# Altium project dubberli_PCB.PrjPcb
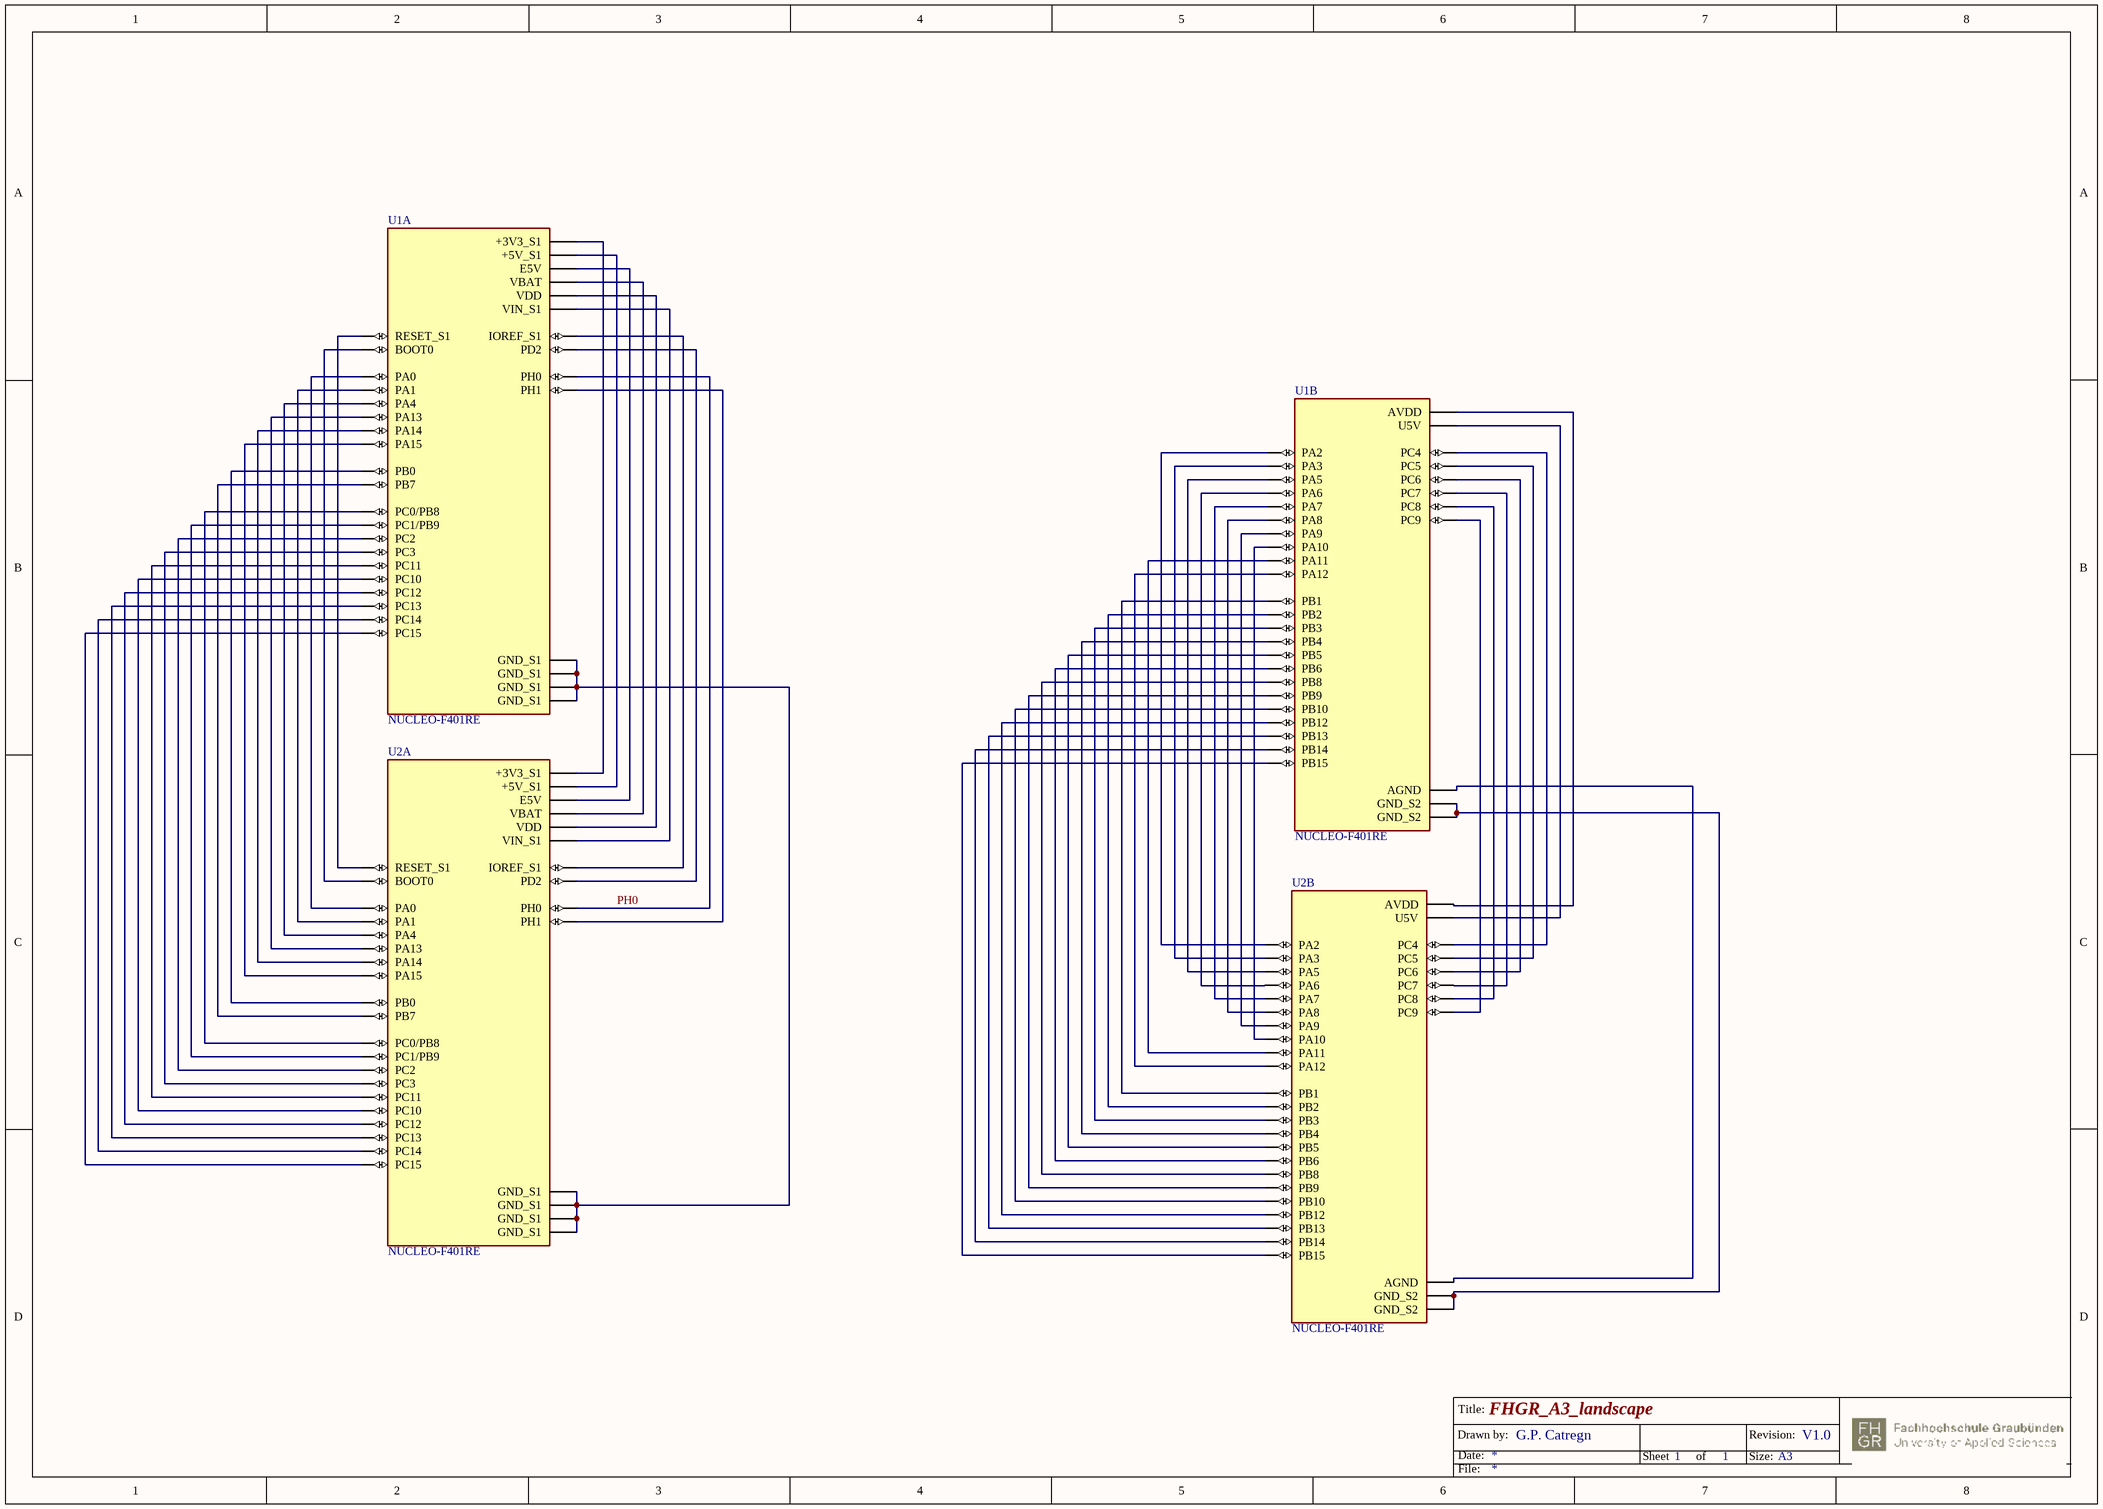
[diagram p0: Sheet1.SchDoc]
1 sheet, 2 parts. Net scope: global (net labels, ports and power ports of the same name join across sheets).
Board file: PCB1.PcbDoc

## Sheet Sheet1.SchDoc: FHGR_A3_landscape
size A3; Date: 18.07.2017; DrawnBy: G.P. Catregn; Organization: HTW Chur; Address1: Pulvermühlestrasse 57; Address2: 7004 Chur; Address3: Switzerland; DocumentNumber: 1; Revision: V1.0; SheetNumber: 1; SheetTotal: 1; DocumentName: HTW Template

### Parts
U1  NUCLEO-F401RE  [ST_NUCLEO-F401RE]  (parts A,B of 6)
U2  NUCLEO-F401RE  [ST_NUCLEO-F401RE]  (parts A,B of 6)

### Nets
PH0: U1.CN7_29(PH0) U2.CN7_29(PH0)
NetU1_CN7_1: U1.CN7_1(PC10) U2.CN7_1(PC10)
NetU1_CN7_2: U1.CN7_2(PC11) U2.CN7_2(PC11)
NetU1_CN7_3: U1.CN7_3(PC12) U2.CN7_3(PC12)
NetU1_CN7_4: U1.CN7_4(PD2) U2.CN7_4(PD2)
NetU1_CN7_5: U1.CN7_5(VDD) U2.CN7_5(VDD)
NetU1_CN7_6: U1.CN7_6(E5V) U2.CN7_6(E5V)
NetU1_CN7_7: U1.CN7_7(BOOT0) U2.CN7_7(BOOT0)
NetU1_CN7_8: U1.CN7_8(GND_S1) U1.CN7_19(GND_S1) U1.CN7_20(GND_S1) U1.CN7_22(GND_S1) U2.CN7_8(GND_S1) U2.CN7_19(GND_S1) U2.CN7_20(GND_S1) U2.CN7_22(GND_S1)
NetU1_CN7_12: U1.CN7_12(IOREF_S1) U2.CN7_12(IOREF_S1)
NetU1_CN7_13: U1.CN7_13(PA13) U2.CN7_13(PA13)
NetU1_CN7_14: U1.CN7_14(RESET_S1) U2.CN7_14(RESET_S1)
NetU1_CN7_15: U1.CN7_15(PA14) U2.CN7_15(PA14)
NetU1_CN7_16: U1.CN7_16(+3V3_S1) U2.CN7_16(+3V3_S1)
NetU1_CN7_17: U1.CN7_17(PA15) U2.CN7_17(PA15)
NetU1_CN7_18: U1.CN7_18(+5V_S1) U2.CN7_18(+5V_S1)
NetU1_CN7_21: U1.CN7_21(PB7) U2.CN7_21(PB7)
NetU1_CN7_23: U1.CN7_23(PC13) U2.CN7_23(PC13)
NetU1_CN7_24: U1.CN7_24(VIN_S1) U2.CN7_24(VIN_S1)
NetU1_CN7_25: U1.CN7_25(PC14) U2.CN7_25(PC14)
NetU1_CN7_27: U1.CN7_27(PC15) U2.CN7_27(PC15)
NetU1_CN7_28: U1.CN7_28(PA0) U2.CN7_28(PA0)
NetU1_CN7_30: U1.CN7_30(PA1) U2.CN7_30(PA1)
NetU1_CN7_31: U1.CN7_31(PH1) U2.CN7_31(PH1)
NetU1_CN7_32: U1.CN7_32(PA4) U2.CN7_32(PA4)
NetU1_CN7_33: U1.CN7_33(VBAT) U2.CN7_33(VBAT)
NetU1_CN7_34: U1.CN7_34(PB0) U2.CN7_34(PB0)
NetU1_CN7_35: U1.CN7_35(PC2) U2.CN7_35(PC2)
NetU1_CN7_36: U1.CN7_36(PC1/PB9) U2.CN7_36(PC1/PB9)
NetU1_CN7_37: U1.CN7_37(PC3) U2.CN7_37(PC3)
NetU1_CN7_38: U1.CN7_38(PC0/PB8) U2.CN7_38(PC0/PB8)
NetU1_CN10_1: U1.CN10_1(PC9) U2.CN10_1(PC9)
NetU1_CN10_2: U1.CN10_2(PC8) U2.CN10_2(PC8)
NetU1_CN10_3: U1.CN10_3(PB8) U2.CN10_3(PB8)
NetU1_CN10_4: U1.CN10_4(PC6) U2.CN10_4(PC6)
NetU1_CN10_5: U1.CN10_5(PB9) U2.CN10_5(PB9)
NetU1_CN10_6: U1.CN10_6(PC5) U2.CN10_6(PC5)
NetU1_CN10_7: U1.CN10_7(AVDD) U2.CN10_7(AVDD)
NetU1_CN10_8: U1.CN10_8(U5V) U2.CN10_8(U5V)
NetU1_CN10_9: U1.CN10_9(GND_S2) U1.CN10_20(GND_S2) U2.CN10_9(GND_S2) U2.CN10_20(GND_S2)
NetU1_CN10_11: U1.CN10_11(PA5) U2.CN10_11(PA5)
NetU1_CN10_12: U1.CN10_12(PA12) U2.CN10_12(PA12)
NetU1_CN10_13: U1.CN10_13(PA6) U2.CN10_13(PA6)
NetU1_CN10_14: U1.CN10_14(PA11) U2.CN10_14(PA11)
NetU1_CN10_15: U1.CN10_15(PA7) U2.CN10_15(PA7)
NetU1_CN10_16: U1.CN10_16(PB12) U2.CN10_16(PB12)
NetU1_CN10_17: U1.CN10_17(PB6) U2.CN10_17(PB6)
NetU1_CN10_19: U1.CN10_19(PC7) U2.CN10_19(PC7)
NetU1_CN10_21: U1.CN10_21(PA9) U2.CN10_21(PA9)
NetU1_CN10_22: U1.CN10_22(PB2) U2.CN10_22(PB2)
NetU1_CN10_23: U1.CN10_23(PA8) U2.CN10_23(PA8)
NetU1_CN10_24: U1.CN10_24(PB1) U2.CN10_24(PB1)
NetU1_CN10_25: U1.CN10_25(PB10) U2.CN10_25(PB10)
NetU1_CN10_26: U1.CN10_26(PB15) U2.CN10_26(PB15)
NetU1_CN10_27: U1.CN10_27(PB4) U2.CN10_27(PB4)
NetU1_CN10_28: U1.CN10_28(PB14) U2.CN10_28(PB14)
NetU1_CN10_29: U1.CN10_29(PB5) U2.CN10_29(PB5)
NetU1_CN10_30: U1.CN10_30(PB13) U2.CN10_30(PB13)
NetU1_CN10_31: U1.CN10_31(PB3) U2.CN10_31(PB3)
NetU1_CN10_32: U1.CN10_32(AGND) U2.CN10_32(AGND)
NetU1_CN10_33: U1.CN10_33(PA10) U2.CN10_33(PA10)
NetU1_CN10_34: U1.CN10_34(PC4) U2.CN10_34(PC4)
NetU1_CN10_35: U1.CN10_35(PA2) U2.CN10_35(PA2)
NetU1_CN10_37: U1.CN10_37(PA3) U2.CN10_37(PA3)

### Notes on the sheet
- Drawn by:
- Title:
- Date:
- Sheet
- of
- Size:
- Revision:
- A3
- File:

### Library data of the parts
U1 U2 = NUCLEO-F401RE: STM32 Nucleo-64 development board with STM32F401RET6 MCU, supports Arduino and ST morpho connectivity; Value: *; MP: NUCLEO-F401RE; Package: None; Availability: Unavailable; Price: None